# Altium project 直流光电.PrjPCB
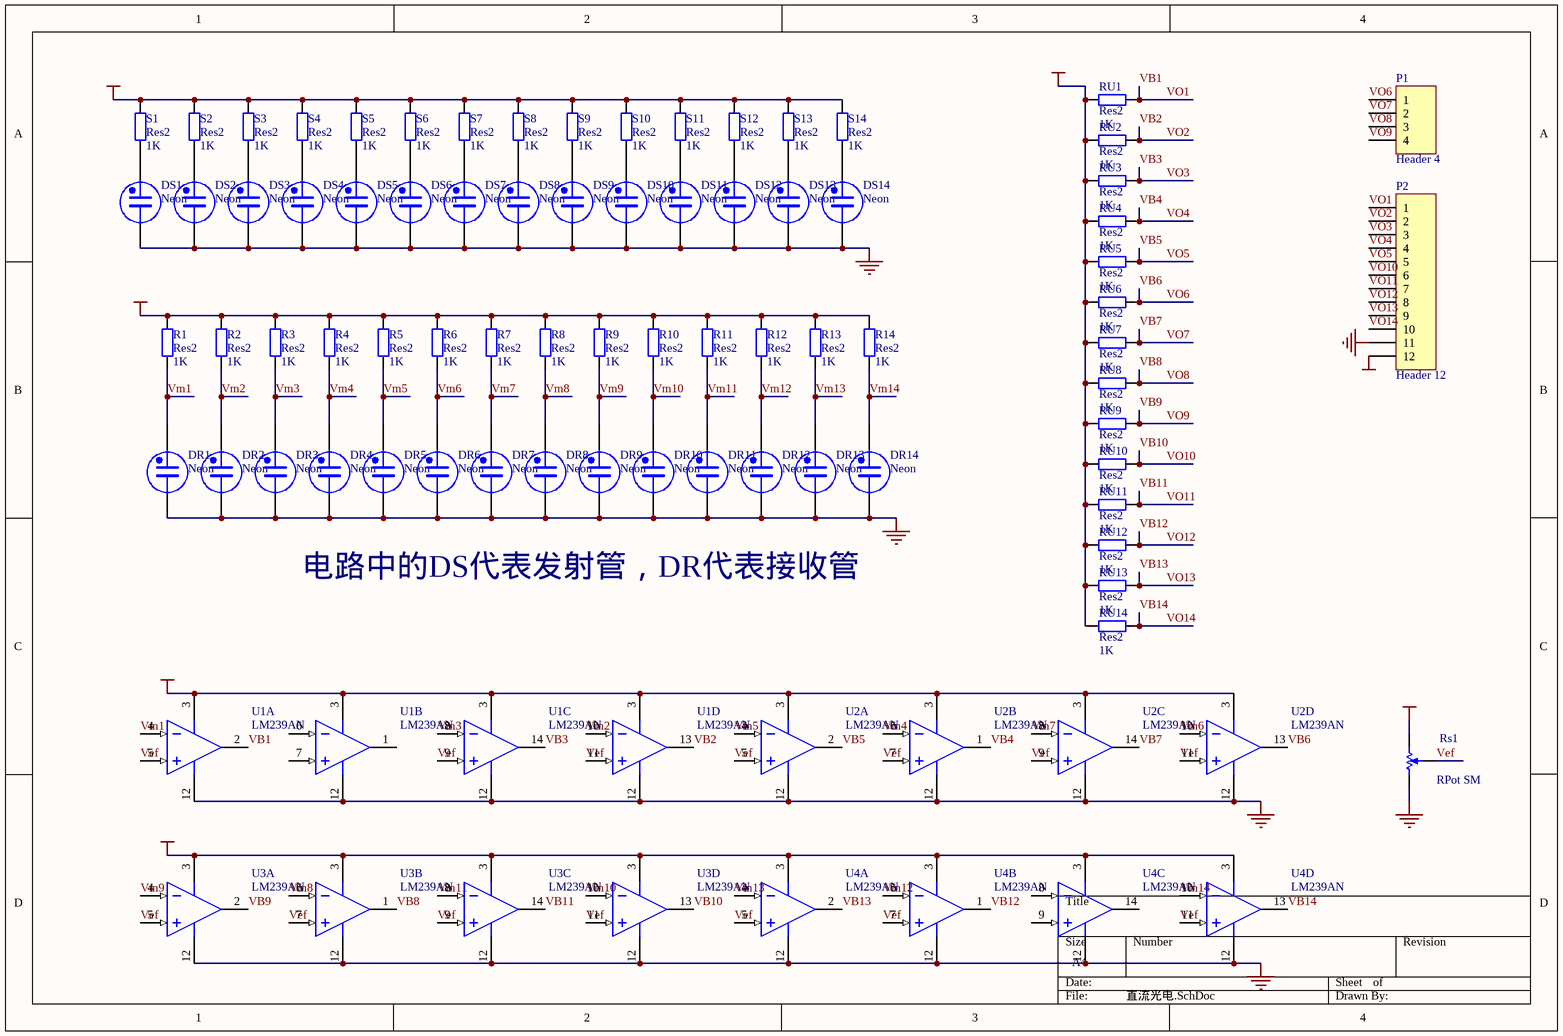
[diagram p0: 直流光电.SchDoc]
1 sheet, 77 parts. Net scope: global (net labels, ports and power ports of the same name join across sheets).
Board file: 直流光电.PCBDOC

## Sheet 直流光电.SchDoc
size A4

### Parts
DR1  Neon  [PIN2]
DR2  Neon  [PIN2]
DR3  Neon  [PIN2]
DR4  Neon  [PIN2]
DR5  Neon  [PIN2]
DR6  Neon  [PIN2]
DR7  Neon  [PIN2]
DR8  Neon  [PIN2]
DR9  Neon  [PIN2]
DR10  Neon  [PIN2]
DR11  Neon  [PIN2]
DR12  Neon  [PIN2]
DR13  Neon  [PIN2]
DR14  Neon  [PIN2]
DS1  Neon  [PIN2]
DS2  Neon  [PIN2]
DS3  Neon  [PIN2]
DS4  Neon  [PIN2]
DS5  Neon  [PIN2]
DS6  Neon  [PIN2]
DS7  Neon  [PIN2]
DS8  Neon  [PIN2]
DS9  Neon  [PIN2]
DS10  Neon  [PIN2]
DS11  Neon  [PIN2]
DS12  Neon  [PIN2]
DS13  Neon  [PIN2]
DS14  Neon  [PIN2]
P1  Header 4  [HDR1X4]
P2  Header 12  [HDR1X12]
R1  Res2  value 1K  [AXIAL-0.4]
R2  Res2  value 1K  [AXIAL-0.4]
R3  Res2  value 1K  [AXIAL-0.4]
R4  Res2  value 1K  [AXIAL-0.4]
R5  Res2  value 1K  [AXIAL-0.4]
R6  Res2  value 1K  [AXIAL-0.4]
R7  Res2  value 1K  [AXIAL-0.4]
R8  Res2  value 1K  [AXIAL-0.4]
R9  Res2  value 1K  [AXIAL-0.4]
R10  Res2  value 1K  [AXIAL-0.4]
R11  Res2  value 1K  [AXIAL-0.4]
R12  Res2  value 1K  [AXIAL-0.4]
R13  Res2  value 1K  [AXIAL-0.4]
R14  Res2  value 1K  [AXIAL-0.4]
Rs1  RPot SM  [POT4MM-2]
RU1  Res2  value 1K  [AXIAL-0.4]
RU2  Res2  value 1K  [AXIAL-0.4]
RU3  Res2  value 1K  [AXIAL-0.4]
RU4  Res2  value 1K  [AXIAL-0.4]
RU5  Res2  value 1K  [AXIAL-0.4]
RU6  Res2  value 1K  [AXIAL-0.4]
RU7  Res2  value 1K  [AXIAL-0.4]
RU8  Res2  value 1K  [AXIAL-0.4]
RU9  Res2  value 1K  [AXIAL-0.4]
RU10  Res2  value 1K  [AXIAL-0.4]
RU11  Res2  value 1K  [AXIAL-0.4]
RU12  Res2  value 1K  [AXIAL-0.4]
RU13  Res2  value 1K  [AXIAL-0.4]
RU14  Res2  value 1K  [AXIAL-0.4]
S1  Res2  value 1K  [AXIAL-0.4]
S2  Res2  value 1K  [AXIAL-0.4]
S3  Res2  value 1K  [AXIAL-0.4]
S4  Res2  value 1K  [AXIAL-0.4]
S5  Res2  value 1K  [AXIAL-0.4]
S6  Res2  value 1K  [AXIAL-0.4]
S7  Res2  value 1K  [AXIAL-0.4]
S8  Res2  value 1K  [AXIAL-0.4]
S9  Res2  value 1K  [AXIAL-0.4]
S10  Res2  value 1K  [AXIAL-0.4]
S11  Res2  value 1K  [AXIAL-0.4]
S12  Res2  value 1K  [AXIAL-0.4]
S13  Res2  value 1K  [AXIAL-0.4]
S14  Res2  value 1K  [AXIAL-0.4]
U1  LM239AN  [DIP14]  (parts A,B,C,D of 4)
U2  LM239AN  [DIP14]  (parts A,B,C,D of 4)
U3  LM239AN  [DIP14]  (parts A,B,C,D of 4)
U4  LM239AN  [DIP14]  (parts A,B,C,D of 4)

### Nets
GND: DR1.2 DR2.2 DR3.2 DR4.2 DR5.2 DR6.2 DR7.2 DR8.2 DR9.2 DR10.2 DR11.2 DR12.2 DR13.2 DR14.2 DS1.2 DS2.2 DS3.2 DS4.2 DS5.2 DS6.2 DS7.2 DS8.2 DS9.2 DS10.2 DS11.2 DS12.2 DS13.2 DS14.2 P2.11 Rs1.CCW(-) U1.12(V-) U2.12(V-) U3.12(V-) U4.12(V-)
VCC: P2.12 R1.2 R2.2 R3.2 R4.2 R5.2 R6.2 R7.2 R8.2 R9.2 R10.2 R11.2 R12.2 R13.2 R14.2 Rs1.CW(+) RU1.1 RU2.1 RU3.1 RU4.1 RU5.1 RU6.1 RU7.1 RU8.1 RU9.1 RU10.1 RU11.1 RU12.1 RU13.1 RU14.1 S1.2 S2.2 S3.2 S4.2 S5.2 S6.2 S7.2 S8.2 S9.2 S10.2 S11.2 S12.2 S13.2 S14.2 U1.3(V+) U2.3(V+) U3.3(V+) U4.3(V+)
VB1: P2.1 RU1.2 U1.2(OUT)  [also labelled VO1]
VB2: P2.2 RU2.2 U1.13(OUT)  [also labelled VO2]
VB3: P2.3 RU3.2 U1.14(OUT)  [also labelled VO3]
VB4: P2.4 RU4.2 U2.1(OUT)  [also labelled VO4]
VB5: P2.5 RU5.2 U2.2(OUT)  [also labelled VO5]
VB6: P1.1 RU6.2 U2.13(OUT)  [also labelled VO6]
VB7: P1.2 RU7.2 U2.14(OUT)  [also labelled VO7]
VB8: P1.3 RU8.2 U3.1(OUT)  [also labelled VO8]
VB9: P1.4 RU9.2 U3.2(OUT)  [also labelled VO9]
VB10: P2.6 RU10.2 U3.13(OUT)  [also labelled VO10]
VB11: P2.7 RU11.2 U3.14(OUT)  [also labelled VO11]
VB12: P2.8 RU12.2 U4.1(OUT)  [also labelled VO12]
VB13: P2.9 RU13.2 U4.2(OUT)  [also labelled VO13]
VB14: P2.10 RU14.2 U4.13(OUT)  [also labelled VO14]
Vef: Rs1.W U1.5(IN+) U1.9(IN+) U1.11(IN+) U2.5(IN+) U2.7(IN+) U2.9(IN+) U2.11(IN+) U3.5(IN+) U3.7(IN+) U3.9(IN+) U3.11(IN+) U4.5(IN+) U4.7(IN+) U4.11(IN+)
Vm1: DR1.1 R1.1 U1.4(IN-)
Vm2: DR2.1 R2.1 U1.10(IN-)
Vm3: DR3.1 R3.1 U1.8(IN-)
Vm4: DR4.1 R4.1 U2.6(IN-)
Vm5: DR5.1 R5.1 U2.4(IN-)
Vm6: DR6.1 R6.1 U2.10(IN-)
Vm7: DR7.1 R7.1 U2.8(IN-)
Vm8: DR8.1 R8.1 U3.6(IN-)
Vm9: DR9.1 R9.1 U3.4(IN-)
Vm10: DR10.1 R10.1 U3.10(IN-)
Vm11: DR11.1 R11.1 U3.8(IN-)
Vm12: DR12.1 R12.1 U4.6(IN-)
Vm13: DR13.1 R13.1 U4.4(IN-)
Vm14: DR14.1 R14.1 U4.10(IN-)
NetDS1_1: DS1.1 S1.1
NetDS2_1: DS2.1 S2.1
NetDS3_1: DS3.1 S3.1
NetDS4_1: DS4.1 S4.1
NetDS5_1: DS5.1 S5.1
NetDS6_1: DS6.1 S6.1
NetDS7_1: DS7.1 S7.1
NetDS8_1: DS8.1 S8.1
NetDS9_1: DS9.1 S9.1
NetDS10_1: DS10.1 S10.1
NetDS11_1: DS11.1 S11.1
NetDS12_1: DS12.1 S12.1
NetDS13_1: DS13.1 S13.1
NetDS14_1: DS14.1 S14.1

Not connected (* = marked no-connect by the designer): U1 1(OUT) 6(IN-) 7(IN+); U4 8(IN-) 9(IN+) 14(OUT)

### Notes on the sheet
- 电路中的DS代表发射管，DR代表接收管

### Library data of the parts
DR1-DR14 DS1-DS14 = Neon: Neon Bulb; Published: 24-Mar-1999; LatestRevisionDate: 17-Jul-2002; LatestRevisionNote: Re-released for DXP Platform.; Publisher: Altium Limited
P1 = Header 4: Header, 4-Pin; LatestRevisionDate: 17-Jul-2002; LatestRevisionNote: Re-released for DXP Platform.; Publisher: Altium Limited
P2 = Header 12: Header, 12-Pin; LatestRevisionDate: 17-Jul-2002; LatestRevisionNote: Re-released for DXP Platform.; Publisher: Altium Limited
R1-R14 RU1-RU14 S1-S14 = Res2: Resistor; Published: 8-Jun-2000; LatestRevisionDate: 17-Jul-2002; LatestRevisionNote: Re-released for DXP Platform.; Publisher: Altium Limited
Rs1 = RPot SM: Square Trimming Potentiometer; Published: 17-Dec-2003; DatasheetDocument: Oct-2003; Publisher: Altium Limited
U1-U4 = LM239AN: Low-Power Quad Voltage Comparator; Published: 24-Aug-2001; LatestRevisionDate: 17-Jul-2002; LatestRevisionNote: Re-released for DXP Platform.; DatasheetDocument: Jun-1998; PackageDocument: Jan-1997; PackageReference: DIP14; Publisher: Altium Limited